# Altium schematic sheet Bluetooth.SchDoc: Bluetooth Communication
size A4; Date: 2022 Fall; Address1: LK Bulls; Address2: Bagoly Zoltan; Address3: Feher Daniel; Address4: G. Varga Gabor; DocumentNumber: 13; Revision: 1.0; SheetNumber: 13; SheetTotal: 14
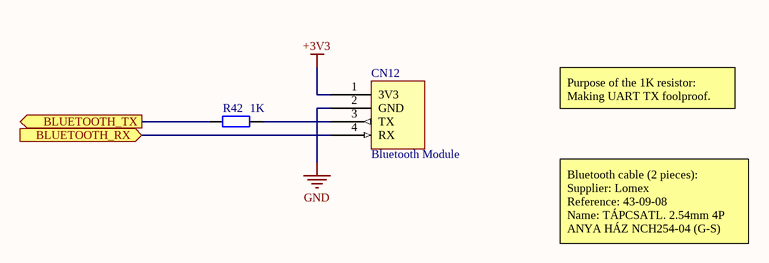
[diagram p0: Bluetooth.SchDoc]

## Parts
CN12  Bluetooth Module  [FP_CONN4_TAP_254MM]
R42  1K  [FP_0805_RES]

## Ports
BLUETOOTH_RX (in), BLUETOOTH_TX (out)

## Nets
+3V3: CN12.1(3V3)
GND: CN12.2(GND)
BLUETOOTH_RX: CN12.4(RX) ; port BLUETOOTH_RX
BLUETOOTH_TX: R42.1 ; port BLUETOOTH_TX
NetCN12_3: CN12.3(TX) R42.2

## Notes on the sheet
- Purpose of the 1K resistor: Making UART TX foolproof.
- Bluetooth cable (2 pieces):
  Supplier: Lomex
  Reference: 43-09-08
  Name: TÁPCSATL. 2.54mm 4P ANYA HÁZ NCH254-04 (G-S)
- Title
- Size:
- Date:
- A4
- Number:
- Revision:
- Sheet
- of
- Designed by:
- File:

## Library data of the parts
CN12 = Connector_HC-05: HC-05 tokozva, kérdés, hogy melyik lábon vannak valójában a dolgok; reference1: 100.416.39 (gombbal); reference2: 100.355.62 (gomb nélkül); reference3: 100.355.65 (master-slave); Name: HC-05 bluetooth modul 4P, master-slave, gombbal; Supplier: Hestore; Reference: 43-08-97
R42 = RES: Resistor; Tolerance: 5%; Power: 0.125W; Name: 1K00 0805 5% CR-05JL7----1K 0.125W (VIK); Supplier: Lomex; Reference: 81-10-87; Value: 1K